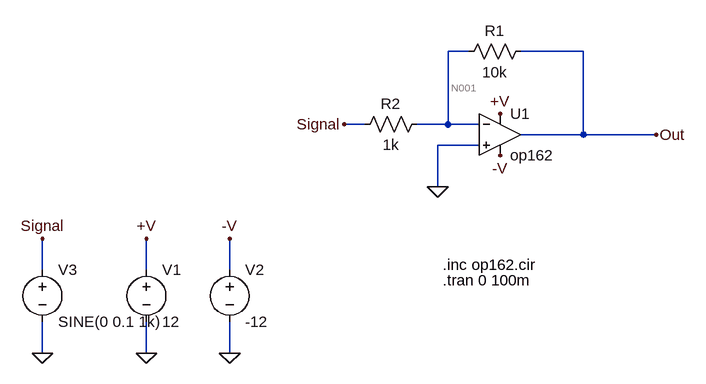
[diagram p0: schematic op162.asc]
op162.asc, the LTspice schematic file:
Version 4.1
SHEET 1 880 680
WIRE 176 16 144 16
WIRE 352 16 256 16
WIRE 16 128 -16 128
WIRE 144 128 144 16
WIRE 144 128 96 128
WIRE 192 128 144 128
WIRE 352 144 352 16
WIRE 352 144 256 144
WIRE 464 144 352 144
WIRE 192 160 128 160
WIRE 128 224 128 160
WIRE -480 352 -480 304
WIRE -320 352 -320 304
WIRE -192 352 -192 304
WIRE -480 480 -480 432
WIRE -320 480 -320 432
WIRE -192 480 -192 432
FLAG -320 480 0
FLAG -192 480 0
FLAG -320 304 +V
FLAG -192 304 -V
FLAG 224 112 +V
FLAG 224 176 -V
FLAG 128 224 0
FLAG -480 480 0
FLAG -480 304 Signal
FLAG -16 128 Signal
FLAG 464 144 Out
SYMBOL OpAmps\\opamp2 224 80 R0
SYMATTR InstName U1
SYMATTR Value op162
SYMBOL voltage -320 336 R0
WINDOW 123 0 0 Left 0
WINDOW 39 0 0 Left 0
SYMATTR InstName V1
SYMATTR Value 12
SYMBOL voltage -192 336 R0
WINDOW 123 0 0 Left 0
WINDOW 39 0 0 Left 0
SYMATTR InstName V2
SYMATTR Value -12
SYMBOL res 272 0 R90
WINDOW 0 0 56 VBottom 2
WINDOW 3 32 56 VTop 2
SYMATTR InstName R1
SYMATTR Value 10k
SYMBOL res 112 112 R90
WINDOW 0 0 56 VBottom 2
WINDOW 3 32 56 VTop 2
SYMATTR InstName R2
SYMATTR Value 1k
SYMBOL voltage -480 336 R0
WINDOW 123 0 0 Left 0
WINDOW 39 0 0 Left 0
SYMATTR InstName V3
SYMATTR Value SINE(0 0.1 1k)
TEXT 136 368 Left 2 !.tran 0 100m
TEXT 136 344 Left 2 !.inc op162.cir

The netlist it stands for:
* op162.asc
X§U1 0 N001 +V -V Out op162  ; pins In+ In- V+ V- OUT
V1 +V 0 12
V2 -V 0 -12
R1 Out N001 10k
R2 N001 Signal 1k
V3 Signal 0 SINE(0 0.1 1k)
.tran 0 100m
.inc op162.cir
.backanno
.end

* Results of the author's LTspice run, read from the files saved beside the schematic
* Operating Point, zero values left out:
*   V(+v) = 12 V
*   V(out) = -21.34 mV
*   V(n001) = -1.718 mV
*   V(-v) = -12 V
*   I(V1) = -626.9 µA
*   I(R1) = -1.962 µA
*   I(R2) = -1.718 µA
*   I(V2) = 628.4 µA
*   I(V3) = -1.718 µA
*   Ix(u1:1) = -223.8 nA
*   Ix(u1:2) = -243.7 nA
*   Ix(u1:99) = 626.9 µA
*   Ix(u1:50) = -628.4 µA
*   Ix(u1:45) = 1.962 µA
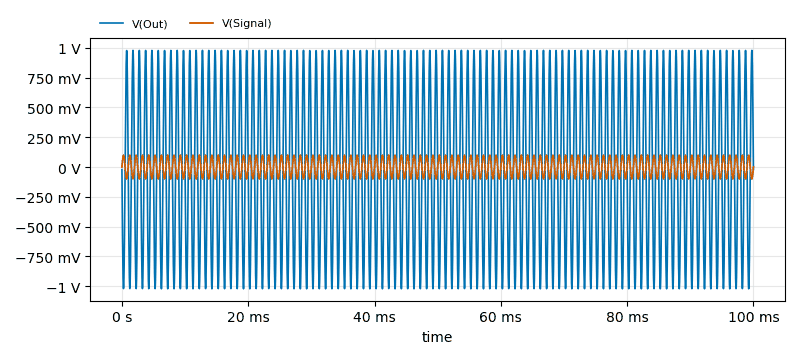
[diagram p1: Transient Analysis of op162.asc, plotted from the saved traces]
* Transient Analysis, 1 run:
*   V(Out): min -1.021 V, max 978.6 mV, average -21.24 mV, rms 710.4 mV, last -20.99 mV
*   V(Signal): min -100 mV, max 100 mV, average -9.524 µV, rms 71.02 mV, last 0 V